# Altium schematic sheet DM_V1_JTAG_CONF_connectors.SchDoc: JTAG, PROM
size Letter; Author: Evgeny Kirshin; Engineer: Evgeny Kirshin; Revision: 0.1; ProjectName: DM_V1
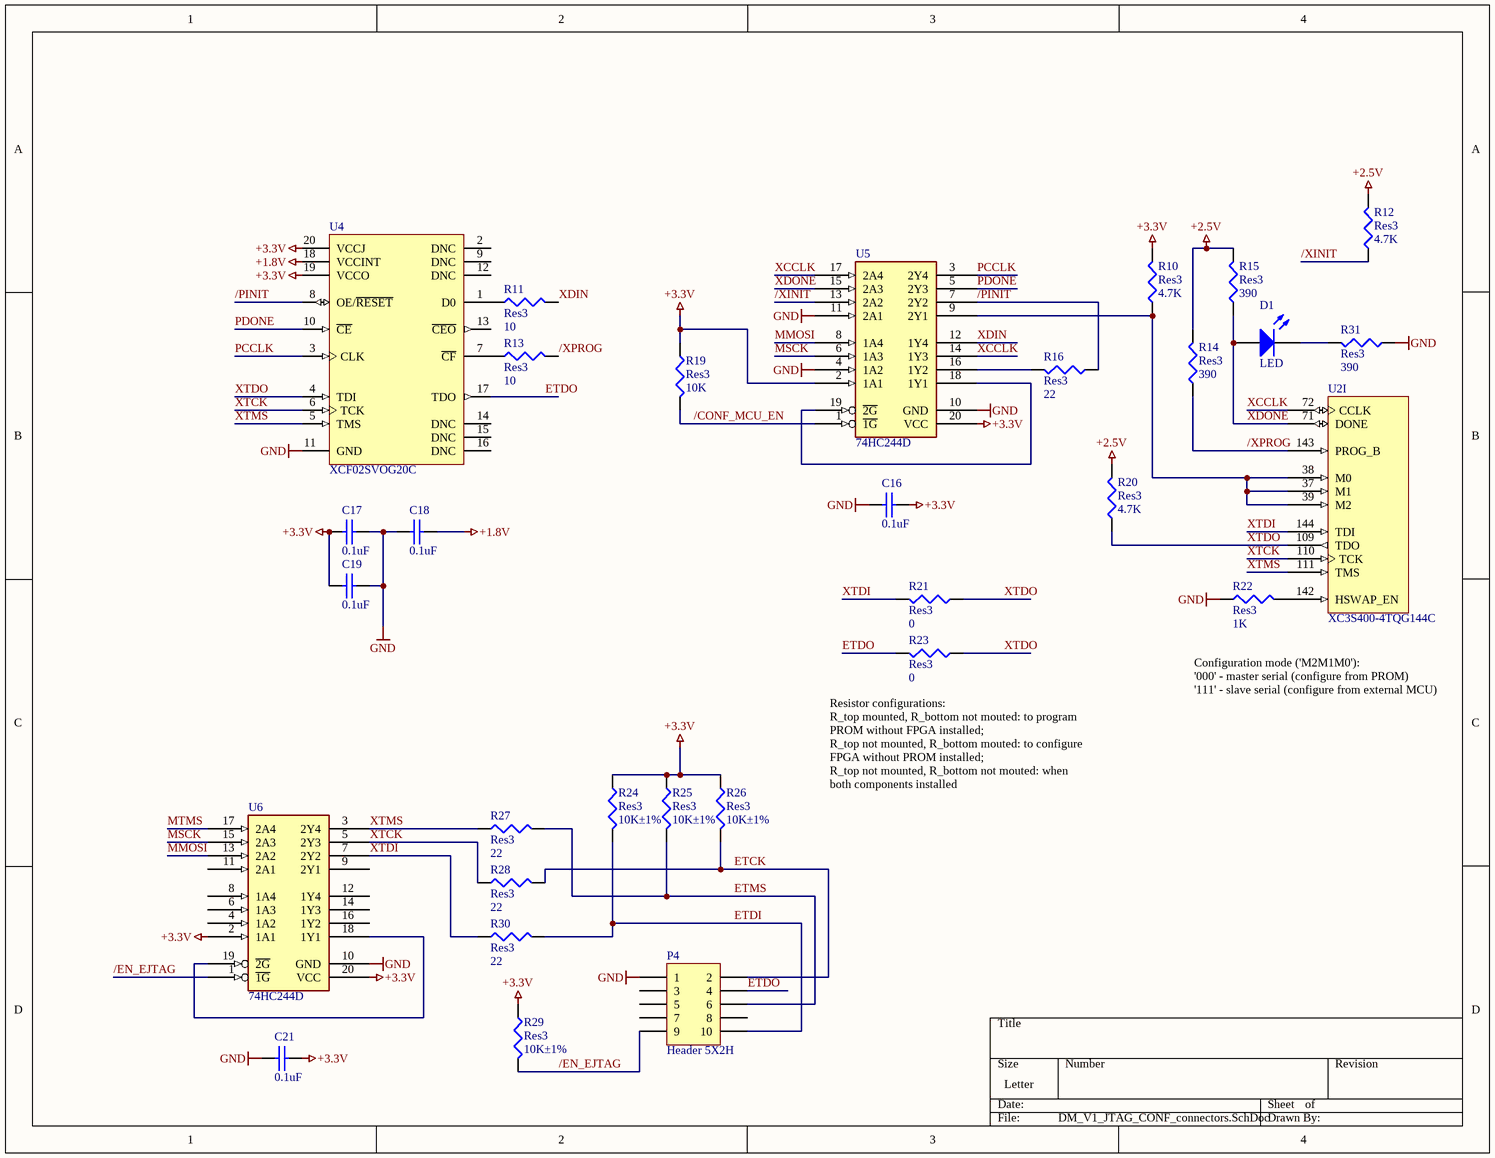
[diagram p0: DM_V1_JTAG_CONF_connectors.SchDoc]

## Parts
C16  value 0.1uF  [1608[0603]]  (hidden comment: 0.1)
C17  value 0.1uF  [1608[0603]]  (hidden comment: 0.1)
C18  value 0.1uF  [1608[0603]]  (hidden comment: 0.1)
C19  value 0.1uF  [1608[0603]]  (hidden comment: 0.1)
C21  value 0.1uF  [1608[0603]]  (hidden comment: 0.1)
D1  LED  [1608[0603]]
P4  Header 5X2H  [HDR2X5H]
R10  Res3  value 4.7K  [J1-0603]
R11  Res3  value 10  [J1-0603]
R12  Res3  value 4.7K  [J1-0603]
R13  Res3  value 10  [J1-0603]
R14  Res3  value 390  [J1-0603]
R15  Res3  value 390  [J1-0603]
R16  Res3  value 22  [J1-0603]
R19  Res3  value 10K  [J1-0603]
R20  Res3  value 4.7K  [J1-0603]
R21  Res3  value 0  [J1-0603]
R22  Res3  value 1K  [J1-0603]
R23  Res3  value 0  [J1-0603]
R24  Res3  value 10K±1%  [J1-0603]
R25  Res3  value 10K±1%  [J1-0603]
R26  Res3  value 10K±1%  [J1-0603]
R27  Res3  value 22  [J1-0603]
R28  Res3  value 22  [J1-0603]
R29  Res3  value 10K±1%  [J1-0603]
R30  Res3  value 22  [J1-0603]
R31  Res3  value 390  [J1-0603]
U2  XC3S400-4TQG144C  [TQG144_N]  (part I of 11)
U4  XCF02SVOG20C  [VOG20_N]
U5  74HC244D  [SOP127P1030X265-20N]
U6  74HC244D  [SOP127P1030X265-20N]

## Nets
+1.8V: C18.1 U4.18(VCCINT)
+2.5V: R12.2 R14.2 R15.2 R20.2
+3.3V: C16.1 C17.2 C19.2 C21.1 R10.2 R19.1 R24.1 R25.1 R26.1 R29.1 U4.19(VCCO) U4.20(VCCJ) U5.2(1A1) U5.20(VCC) U6.2(1A1) U6.20(VCC)
GND: C16.2 C17.1 C18.2 C19.1 C21.2 P4.1 R22.1 R31.1 U4.11(GND) U5.4(1A2) U5.10(GND) U5.11(2A1) U6.10(GND)
/CONF_MCU_EN: R19.2 U5.1(~{1G})
/EN_EJTAG: P4.9 R29.2 U6.1(~{1G})
/PINIT: R16.1 U4.8(OE/~{RESET}) U5.7(2Y2)
/XINIT: R12.1 U5.13(2A2)
/XPROG: R13.2 R14.1 U2.143(PROG_B)
ETCK: P4.2 R26.2 R28.2
ETDI: P4.10 R24.2 R30.2
ETDO: P4.4 R23.2 U4.17(TDO)
ETMS: P4.6 R25.2 R27.2
MMOSI: U5.8(1A4) U6.13(2A2)
MSCK: U5.6(1A3) U6.15(2A3)
MTMS: U6.17(2A4)
PCCLK: U4.3(CLK) U5.3(2Y4)
PDONE: U4.10(~{CE}) U5.5(2Y3)
XCCLK: U2.72(CCLK) U5.14(1Y3) U5.17(2A4)
XDIN: R11.2 U5.12(1Y4)
XDONE: D1.1(A) R15.1 U2.71(DONE) U5.15(2A3)
XTCK: R28.1 U2.110(TCK) U4.6(TCK) U6.5(2Y3)
XTDI: R21.2 R30.1 U2.144(TDI) U6.7(2Y2)
XTDO: R20.1 R21.1 R23.1 U2.109(TDO) U4.4(TDI)
XTMS: R27.1 U2.111(TMS) U4.5(TMS) U6.3(2Y4)
NetD1_2: D1.2(K) R31.2
NetR10_1: R10.1 U2.37(M1) U2.38(M0) U2.39(M2) U5.9(2Y1)
NetR11_1: R11.1 U4.1(D0)
NetR13_1: R13.1 U4.7(~{CF})
NetR16_2: R16.2 U5.16(1Y2)
NetR22_2: R22.2 U2.142(HSWAP_EN)
NetU5_18: U5.18(1Y1) U5.19(~{2G})
NetU6_18: U6.18(1Y1) U6.19(~{2G})

Not connected (* = marked no-connect by the designer): P4 3 5 7 8; U4 2(DNC) 9(DNC) 12(DNC) 13(~{CEO}) 14(DNC) 15(DNC) 16(DNC); U6 4(1A2) 6(1A3) 8(1A4) 9(2Y1) 11(2A1) 12(1Y4) 14(1Y3) 16(1Y2)

## Notes on the sheet
- Configuration mode ('M2M1M0'):
  '000' - master serial (configure from PROM)
  '111' - slave serial (configure from external MCU)
- (near R23) Resistor configurations:
  R_top mounted, R_bottom not mouted: to program PROM without FPGA installed;
  R_top not mounted, R_bottom mouted: to configure FPGA without PROM installed;
  R_top not mounted, R_bottom not mouted: when both components installed

## Library data of the parts
C16-C19 C21 = CC0603-0.1MKF X7R: Ceramic Chip-capacitor 0603; Name: Чип-конденсатор 0603-0.1 мкФ X7R; Dielectric: X7R; Voltage: 25; Vendor1: KEMET Electronics Corporation, USA; Vendor2: Samsung, Korea; Vendor3: AVX Corporation; Vendor1Name: C0603C104K3RAC; Vendor2Name: CL10B104KA8NNNC; Vendor3Name: 06033C104KAT2A; Ta: -55+125; Type: Capacitor
D1 = LED2: Typical RED, GREEN, YELLOW, AMBER GaAs LED; Published: 8-Jun-2000; LatestRevisionDate: 17-Jul-2002; LatestRevisionNote: Re-released for DXP Platform.; PackageVersion: Feb-2002; PackageReference: 3.2X1.6X1.1; Publisher: Altium Limited; PackageDescription: SM LED; 2 Flat Leads
P4 = Header 5X2H: Header, 5-Pin, Dual row, Right Angle; LatestRevisionDate: 17-Jul-2002; LatestRevisionNote: Re-released for DXP Platform.; Publisher: Altium Limited
R10-R16 R19-R31 = Res3: Resistor; Published: 8-Jun-2000; LatestRevisionDate: 29-May-2009; LatestRevisionNote: IPC-7351 Footprint Added.; PackageReference: J1-0603; Publisher: Altium Limited; PackageDescription: Chip Resistor
U2 = XC3S400-4TQG144C: Spartan-3 1.2V FPGA, 97 User I/Os, 144-Pin TQFP, Standard Performance, Commercial Grade, Pb-Free; OrderingInformation: Additional code may have to be appended for different mask revision devices.; Published: 16-Dec-2005; LatestRevisionDate: 01-Mar-2010; LatestRevisionNote: Updated to datasheet version 2.5 Dec-2009.; DatasheetVersion: ver2.5, Dec-2009; PackageVersion: ver1.2, Jun-2004; PackageReference: TQG144; Publisher: Altium Limited; PackageDescription: 144-Pin Thin Quad Flat Pack (TQG144) - Pb-Free; Supplier 1: Digi-Key; Supplier Part Number 1: XC3S400-4TQG144C-ND; Code_JEDEC: MS-026-BFB; ComponentLink1Description: Spartan-3 Datasheet; ComponentLink1URL: http://www.xilinx.com/support/documentation/data_sheets/ds099.pdf; ComponentLink2Description: TQG144 Package Drawing; ComponentLink2URL: http://www.xilinx.com/support/documentation/package_specs/tq144.pdf; ComponentLink3Description: Spartan-3 Documents; ComponentLink3URL: http://www.xilinx.com/support/documentation/spartan-3.htm; ComponentLink4Description: Xilinx.com Home; ComponentLink4URL: http://www.xilinx.com
U4 = XCF02SVOG20C: XCF00S Series, Platform Flash In-System Programmable Configuration 3.3V PROM, 20-Pin TSOP, 2-Megabit, Commercial Grade, Pb-Free; Published: 4-Mar-2005; DatasheetVersion: ver2.17, Oct-2009; PackageVersion: ver1.3, Dec-2008; PackageReference: VOG20; Publisher: Altium Limited; PackageDescription: 20-Pin Thin Shrink Small Outline Package (VOG20) - Pb-Free; Supplier 1: Digi-Key; Supplier Part Number 1: 122-1287-5-ND; Code_JEDEC: MO-153-AC; ComponentLink1Description: Platform Flash Datasheet; ComponentLink1URL: http://www.xilinx.com/support/documentation/data_sheets/ds123.pdf; ComponentLink2Description: VOG20 Package Drawing; ComponentLink2URL: http://www.xilinx.com/support/documentation/package_specs/vo20.pdf; ComponentLink3Description: Configuration PROM Documents; ComponentLink3URL: http://www.xilinx.com/support/documentation/configuration_proms.htm; ComponentLink4Description: Xilinx.com Home; ComponentLink4URL: http://www.xilinx.com
U5 U6 = 74ALVC244PW: Octal Buffer/Driver Noninverting 3-State Output; ISCode: None; Vendor1: NXP; Ta: -40+85; Type: IC; Name: 74HC244D; Value: 74HC244D